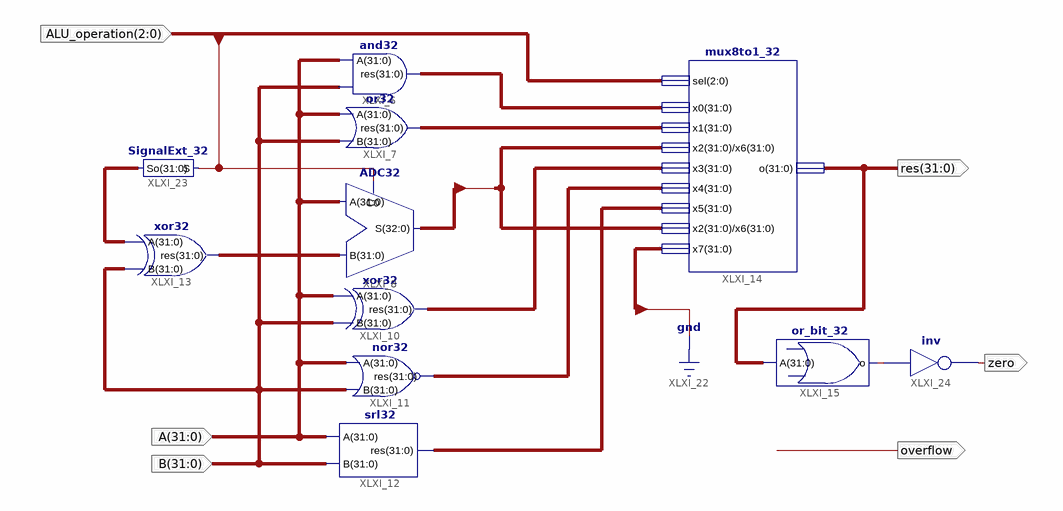
[diagram p0: schematic sheet 1]
// Xilinx ISE schematic ALU.sch (spartan3) as structural Verilog: 11 symbols, 6 ports
module ALU (
  input  [31:0] B,
  input  [31:0] A,
  input  [2:0] ALU_operation,
  output [31:0] res,
  output overflow,
  output zero
);

  wire XLXN_89;
  wire [31:0] XLXN_1, XLXN_7, XLXN_8, XLXN_9, XLXN_36, XLXN_48, XLXN_88;
  wire [32:0] S;

  and32 XLXI_6 (.res(XLXN_1), .A(A), .B(B));
  or32 XLXI_7 (.A(A), .B(B), .res(XLXN_88));
  xor32 XLXI_10 (.A(A), .B(B), .res(XLXN_7));
  nor32 XLXI_11 (.res(XLXN_8), .A(A), .B(B));
  srl32 XLXI_12 (.A(A), .B(B), .res(XLXN_9));
  mux8to1_32 XLXI_14 (
    .x1(XLXN_88), .sel(ALU_operation), .o(res), .x0(XLXN_1), .x2(S[31:0]), .x3(XLXN_7), .x4(XLXN_8),
    .x5(XLXN_9), .x6(S[31:0]), .x7({{31{1'b0}}, S[32]}));
  or_bit_32 XLXI_15 (.o(XLXN_89), .A(res));
  ADC32 XLXI_8 (.B(XLXN_36), .A(A), .C0(ALU_operation[2]), .S(S));
  xor32 XLXI_13 (.A(XLXN_48), .B(B), .res(XLXN_36));
  SignalExt_32 XLXI_23 (.So(XLXN_48), .S(ALU_operation[2]));
  not XLXI_24 (zero, XLXN_89);
endmodule
